# EAGLE design FloppyCircuits_XXYY (EAGLE 9.5.1)
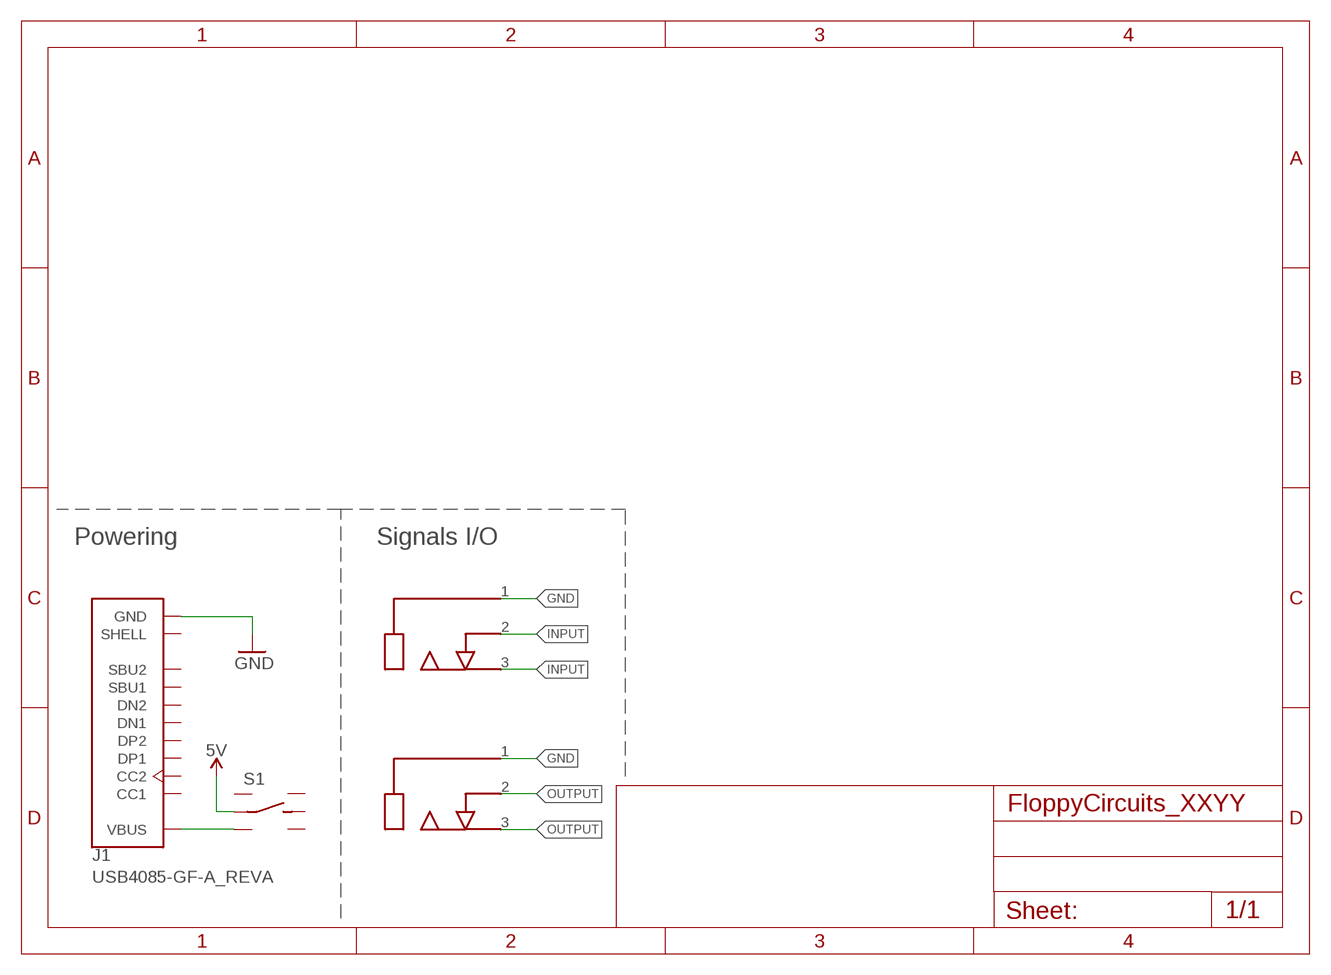
[diagram p0: schematic, sheet 1]

## Parts
J1  USB4085-GF-A_REVA  [GCT_USB4085-GF-A_REVA]
J2  AUDIO_JACK_MONO_3.5  [PJ316_3.5]
J3  AUDIO_JACK_MONO_3.5  [PJ316_3.5]
S1  DPDT_JS202011CQN  [DPDT_JS202011CQN]

## Nets
5V: S1.2(LC)
GND: J1.A1(GND) J1.A12(GND) J1.B1(GND) J1.B12(GND) J2.1 J3.1
INPUT: J2.2 J2.3
N$5: J1.A4(VBUS) J1.A9(VBUS) J1.B4(VBUS) J1.B9(VBUS) S1.3(L2)
OUTPUT: J3.2 J3.3
Unconnected: J1.A5(CC1) J1.A6(DP1) J1.A7(DN1) J1.A8(SBU1) J1.B5(CC2) J1.B6(DP2) J1.B7(DN2) J1.B8(SBU2) J1.P1(SHELL) J1.P2(SHELL) J1.P3(SHELL) J1.P4(SHELL) S1.1(L1) S1.4(R1) S1.5(RC) S1.6(R2)

## Notes on the sheet
- Powering | Signals I/O

## Library data of the parts
J1 = SpaceDIY_connectors:USB4085-GF-A_REVA: USB 2.0 Type C Receptacle Dip Type, PCB Top Mount Check prices <https://pricing.snapeda.com/parts/USB4085-GF-A/Global%20Connector%20Technology/view-part?ref=eda>; AVAILABILITY: In Stock; DESCRIPTION: USB-C (USB TYPE-C) USB 2.0 Receptacle Connector 24 (16+8 Dummy) Position Through Hole, Right Angle, low cost, 3.46mm profile, 16 pin, horizontal, Top mount; MF: Global Connector Technology; MP: USB4085-GF-A; PACKAGE: None; PRICE: None; PURCHASE-URL: https://pricing.snapeda.com/search/part/USB4085-GF-A/?ref=eda
J2 J3 = SpaceDIY_connectors:AUDIO_JACK_MONO_3.5
S1 = bt_electromech:DPDT: Dual Position, Dual Throw (DPDT) Switch

## Board
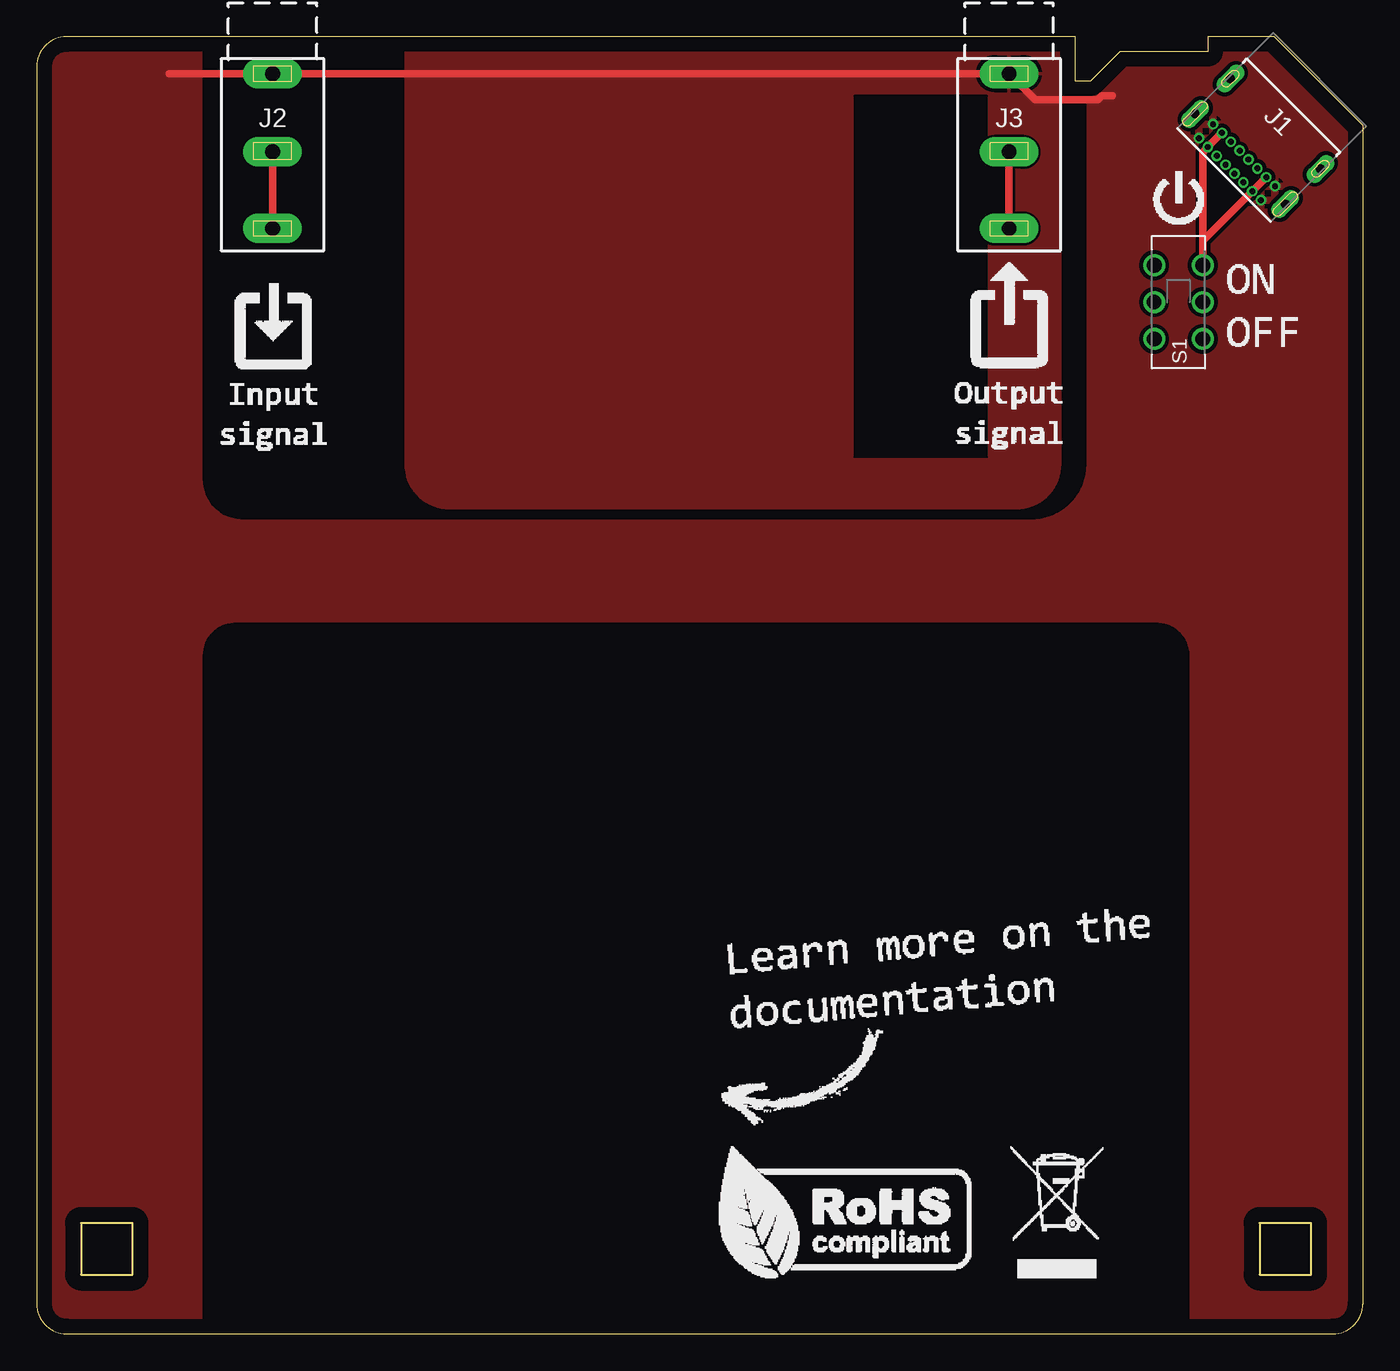
[diagram p1: board, top side]
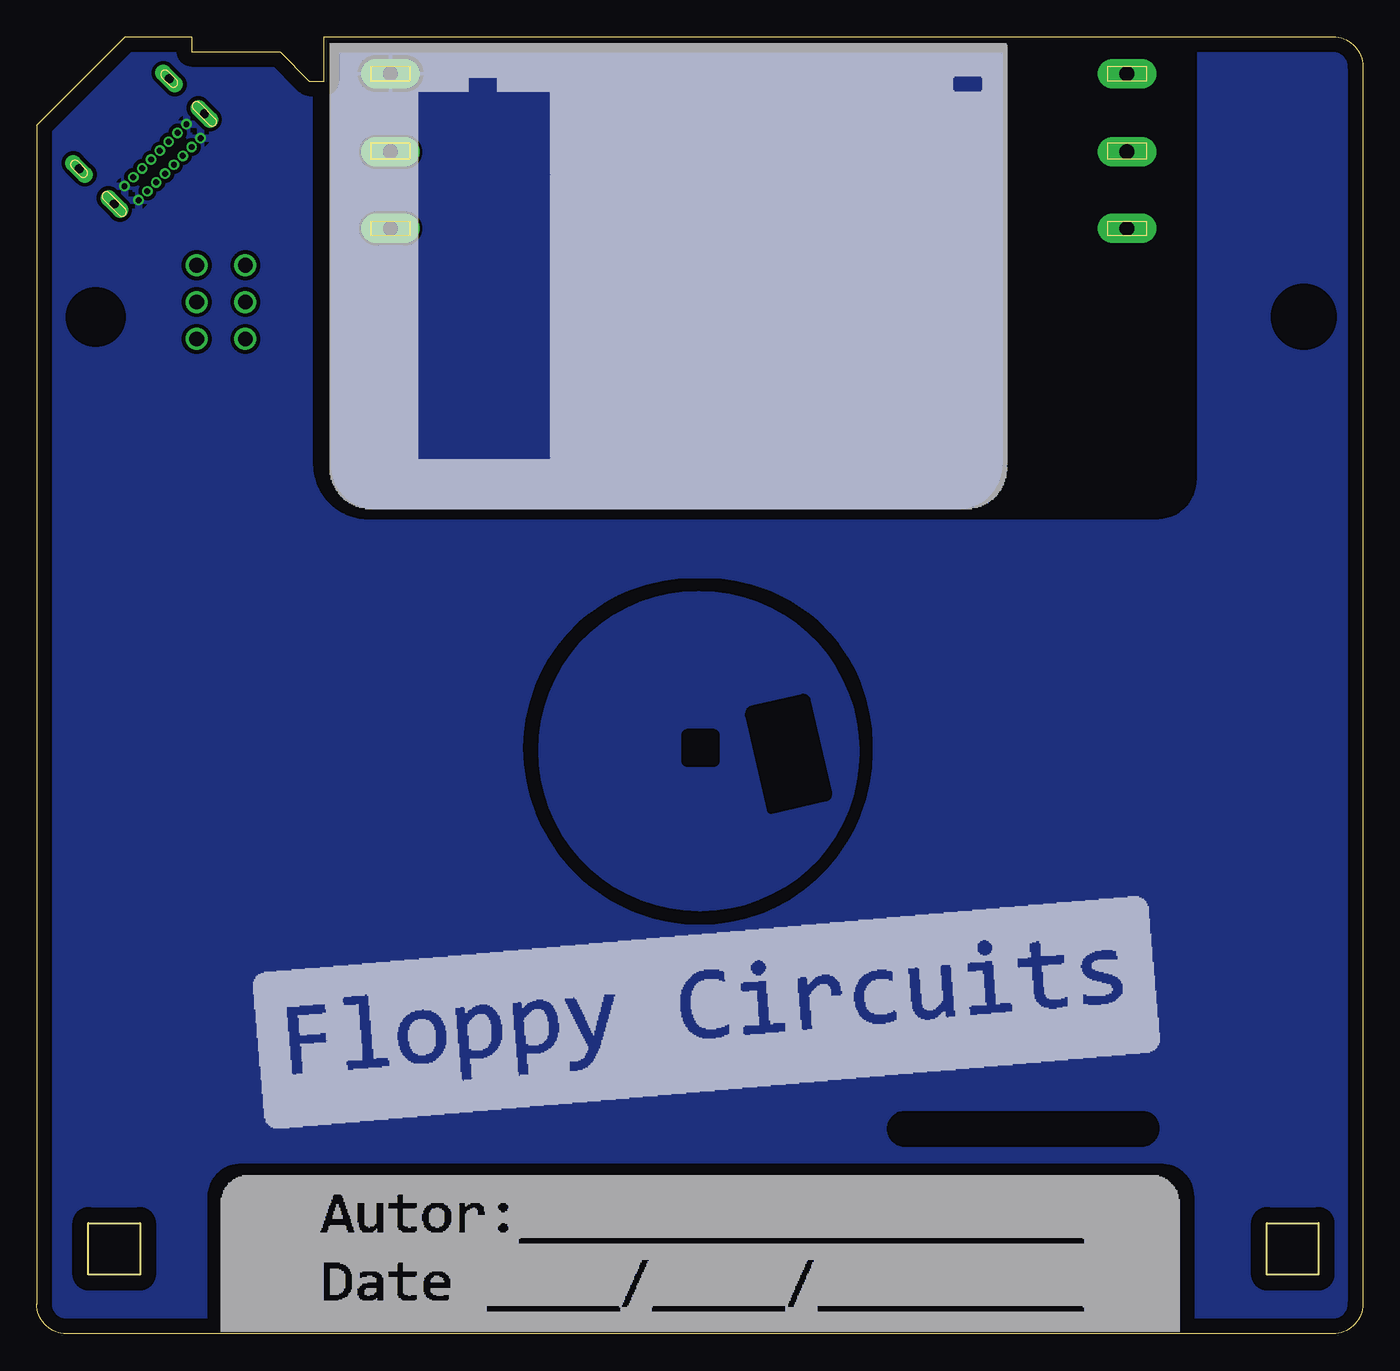
[diagram p2: board, bottom side, seen from below]

Size 90 x 88 mm. Coordinates in mm from the lower left corner, seen from the top.
Outline: 0,2 arc90 2,0 88,0 arc90 90,2 90,82 84,88 79.5,88 79.5,87 73.5,87 71.5,85 70.5,85 70.5,88 2,88 arc90 0,86 0,2
Outline: 3,4 6.5,4 6.5,7.5 3,7.5 3,4
Outline: 83,4 86.5,4 86.5,7.5 83,7.5 83,4
Copper layers (1*16): Top 0.035mm / dielectric 1.5mm / Bottom 0.035mm
Design rules "default *": minimum track width 6mil, minimum drill 0.35mm, track to track 6mil, track to pad 6mil, pad to pad 6mil, via to via 4mil, smd to smd 6mil, copper to edge 40mil, drill to drill 4mil, minimum pad ring 6mil, minimum via ring 8mil, stop-mask expansion 4mil, vias tented up to drill 0mil, thermal gap 10mil
tRestrict: area 55.5,59.5 to 64.5,84
bRestrict: area 36.1,35.3 to 41.9,43.4; area 43.7,38.5 to 46.2,41; area 14.1,13 to 32,14.8; area 3.3,68.3 to 4.7,69.7; area 85.5,68.5 to 86.5,69.5

### Footprints (pad centres in the part's own frame; a part is rotated, then mirrored left to right if it is on the bottom)
GCT_USB4085-GF-A_REVA = drill 0.4 pad 0.65: A1 -2.975,4.025; A4 -2.125,4.025; A5 -1.275,4.025; A6 -0.425,4.025; A7 0.425,4.025; A8 1.275,4.025; A9 2.125,4.025; A12 2.975,4.025; B1 2.975,2.675; B4 2.125,2.675; B5 1.275,2.675; B6 0.425,2.675; B7 -0.425,2.675; B8 -1.275,2.675; B9 -2.125,2.675; B12 -2.975,2.675 | drill 0.6 pad 1.108 long: P1 -4.325,3.045; P2 4.325,3.045; P3 4.325,-0.335; P4 -4.325,-0.335
PJ316_3.5 = drill 1 pad 2 long: 1 0,1; 2 0,6.3; 3 0,11.5
DPDT_JS202011CQN = drill 1: 1 -2.5,-1.65; 2 0,-1.651; 3 2.5,-1.65; 4 -2.5,1.65; 5 0,1.651; 6 2.5,1.65

### Placement (x,y rotation side)
J1  83.84,81.87 135 top
J2  16,86.5 180 top
J3  66,86.5 180 top
S1  77.5,70 90 top

### Tracks (layer width: path | path; a pad name or v marks a point on that pad's centre or on a via)
GND
  Top 0.508: 73,84 72.3,84 72.03,83.73 67.77,83.73 J3.1 J2.1 9,85.5
  pour Top: 25,89 25,59 arc90 28,56 66.5,56 arc90 69.5,59 69.5,89
  pour Top (isolate 0.254): 11,92.5 11,58 arc90 14,55 67.5,55 arc90 71.5,59 71.5,89 91.5,89 91.5,-3 78.5,-3 78.5,46 arc90 76,48.5 13.5,48.5 arc90 11,46 11,-2.5 -2,-2.5 -2,92.5
  pour Bottom (isolate 0.254): 11,88.5 11,58 arc90 14,55 67.5,55 arc90 71.5,59 71.5,89 91.5,89 91.5,-3 78.67,-3 78.67,9.29 arc90 76.17,11.79 45,11.79 45,27.5 arc90 57.25,39.75 arc90 45.5,51.5 44.5,51.5 arc90 33,40 33,39.46 arc90 44.96,27.5 44.96,11.79 13.67,11.79 arc90 11.17,9.29 11.17,-2.5 -2,-2.5 -2,88.5
  pour Bottom: 70,87 70,59 arc-90 67,56 27.5,56 arc-90 24.5,59 24.5,87
GND_2
  pour Bottom: 44.98,50.35 arc90 34.2,39.58 34.2,39.41 arc90 44.89,28.71 45.06,28.71 arc90 55.92,39.58 arc90 45.15,50.35
INPUT
  Top 0.508: J2.2 J2.3
N$5
  Top 0.508: J1.B9 J1.A4 79.15,74.17 | 79.15,74.17 79.15,74 S1.3 | J1.B4 J1.A9 79.15,80.19 79.15,74.17
OUTPUT
  Top 0.508: J3.2 J3.3